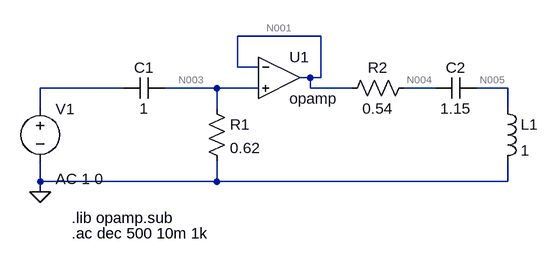
[diagram p0: schematic punto3.asc]
punto3.asc, the LTspice schematic file:
Version 4.1
SHEET 1 880 680
WIRE 432 0 304 0
WIRE 304 48 304 0
WIRE 336 48 304 48
WIRE 416 64 400 64
WIRE 432 64 432 0
WIRE 432 64 416 64
WIRE 128 80 0 80
WIRE 272 80 192 80
WIRE 336 80 272 80
WIRE 416 80 416 64
WIRE 480 80 416 80
WIRE 608 80 560 80
WIRE 720 80 672 80
WIRE 0 112 0 80
WIRE 272 112 272 80
WIRE 720 112 720 80
WIRE 0 224 0 192
WIRE 272 224 272 192
WIRE 272 224 0 224
WIRE 720 224 720 192
WIRE 720 224 272 224
WIRE 0 240 0 224
FLAG 0 240 0
SYMBOL voltage 0 96 R0
WINDOW 123 24 124 Left 2
WINDOW 39 0 0 Left 0
SYMATTR InstName V1
SYMATTR Value ""
SYMATTR Value2 AC 1 0
SYMBOL cap 192 64 R90
WINDOW 0 0 32 VBottom 2
WINDOW 3 32 32 VTop 2
SYMATTR InstName C1
SYMATTR Value 1
SYMBOL res 576 64 R90
WINDOW 0 0 56 VBottom 2
WINDOW 3 32 56 VTop 2
SYMATTR InstName R2
SYMATTR Value 0.54
SYMBOL cap 672 64 R90
WINDOW 0 0 32 VBottom 2
WINDOW 3 32 32 VTop 2
SYMATTR InstName C2
SYMATTR Value 1.15
SYMBOL ind 704 96 R0
SYMATTR InstName L1
SYMATTR Value 1
SYMATTR SpiceLine Rser=1m
SYMBOL res 256 96 R0
SYMATTR InstName R1
SYMATTR Value 0.62
SYMBOL OpAmps\\opamp 368 0 R0
SYMATTR InstName U1
TEXT 48 280 Left 2 !.lib opamp.sub
TEXT 48 304 Left 2 !.ac dec 500 10m 1k

The netlist it stands for:
* punto3.asc
V1 N002 0 AC 1 0
C1 N003 N002 1
R2 N004 N001 0.54
C2 N005 N004 1.15
L1 N005 0 1 Rser=1m
R1 N003 0 0.62
X§U1 N001 N003 N001 opamp Aol=100K GBW=10Meg  ; pins invin noninvin out
.lib opamp.sub
.ac dec 500 10m 1k
.backanno
.end

* Results of the author's LTspice run, read from the files saved beside the schematic
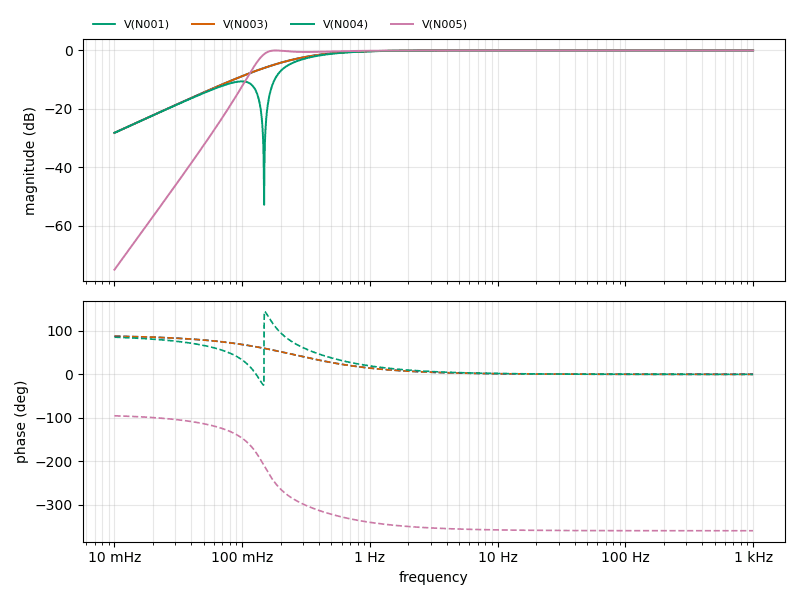
[diagram p1: AC Analysis of punto3.asc, plotted from the saved traces]
* AC Analysis, 1 run:
*   V(N001): -28.20 dB at 10 mHz, -0.00 dB at 1 kHz, peak -0.00 dB at 1 kHz, 3 dB below the peak at 256.7 mHz
*   V(N003): -28.20 dB at 10 mHz, -0.00 dB at 1 kHz, peak -0.00 dB at 1 kHz, 3 dB below the peak at 256.7 mHz
*   V(N004): -28.20 dB at 10 mHz, -0.00 dB at 1 kHz, peak -0.00 dB at 1 kHz, 3 dB below the peak at 297.9 mHz
*   V(N005): -75.02 dB at 10 mHz, -0.00 dB at 1 kHz, peak -0.00 dB at 1 kHz, 3 dB below the peak at 135.9 mHz